# EAGLE schematic shield1 (EAGLE 9.0.1)
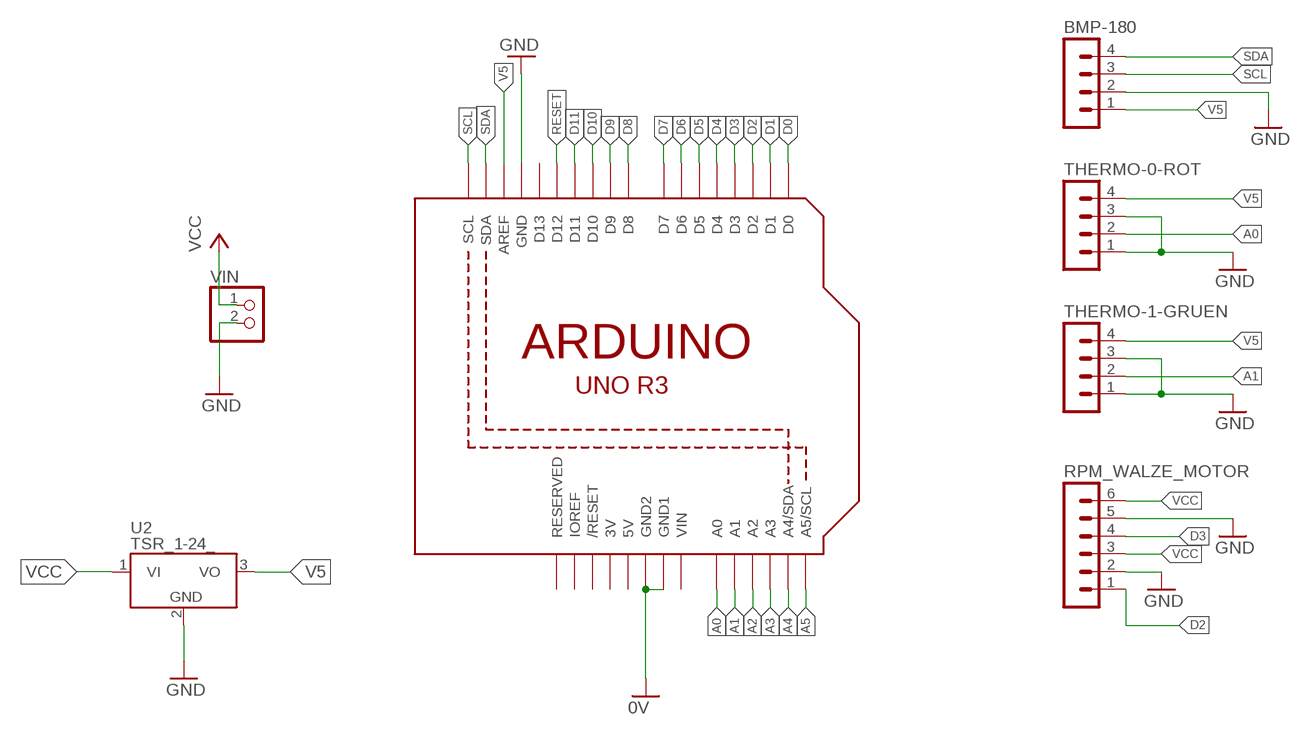
[diagram p0: schematic, sheet 1]

## Parts
BMP-180  MA04-1  [MA04-1]
RPM_WALZE_MOTOR  MA06-1  [MA06-1]
THERMO-0-ROT  MA04-1  [MA04-1]
THERMO-1-GRUEN  MA04-1  [MA04-1]
U1  ARDUINOR3-BPLACE  [ARDUINOR3-BPLACE]
U2  TSR_1-24_  [TSR-1]
VIN  PINHD-1X2  [1X02]

## Nets
A0: THERMO-0-ROT.2 U1.A0
A1: THERMO-1-GRUEN.2 U1.A1
A2: U1.A2
A3: U1.A3
A4: U1.A4(A4/SDA)
A5: U1.A5(A5/SCL)
D0: U1.D0
D1: U1.D1
D2: RPM_WALZE_MOTOR.1 U1.D2
D3: RPM_WALZE_MOTOR.4 U1.D3
D4: U1.D4
D5: U1.D5
D6: U1.D6
D7: U1.D7
D8: U1.D8
D9: U1.D9
D10: U1.D10
D11: U1.D11
GND: BMP-180.2 RPM_WALZE_MOTOR.2 RPM_WALZE_MOTOR.5 THERMO-0-ROT.1 THERMO-0-ROT.3 THERMO-1-GRUEN.1 THERMO-1-GRUEN.3 U1.GND U1.GND1 U1.GND2 U2.2(GND) VIN.2 ; supply symbol labelled 0V
RESET: U1.D12
SCL: BMP-180.3 U1.SCL
SDA: BMP-180.4 U1.SDA
V5: BMP-180.1 THERMO-0-ROT.4 THERMO-1-GRUEN.4 U1.AREF U2.3(VO)
VCC: RPM_WALZE_MOTOR.3 RPM_WALZE_MOTOR.6 U2.1(VI) VIN.1
Unconnected: U1.D13 U1.IOREF U1.RESERVED U1.RESET(/RESET)

## Power pins joined to a net without a drawn wire
3V: U1.3V
5V: U1.5V
VIN: U1.VIN

## Library data of the parts
BMP-180 THERMO-0-ROT THERMO-1-GRUEN = con-lstb:MA04-1: PIN HEADER; OC_FARNELL: unknown; OC_NEWARK: unknown
RPM_WALZE_MOTOR = con-lstb:MA06-1: PIN HEADER; OC_FARNELL: unknown; OC_NEWARK: unknown
U1 = adafruit:ARDUINOR3: This is a new object for the new Arduino R3 - with extra pins that you may want to use (such as IOref, and duplicated A4/A5
U2 = _traco_tsr-1:TSR_1-*: TRACO TSR-1 Series Point-of-Load DC/DC-Converters Vi max. 36 V; Vo = (1.2 .. 15)V ±2%; Io = 0 .. 1 A SIP-Package (drop-in replacement for 78xx linear voltage regulators in TO220-package, vertically assembled) Source: www.tracopower.com Technologies: TSR 1- Vi (V) Vo (V) ±2% Io = 0 .. 1 A 24_ ( generic ) 2412 4.6 .. 36 1.2 2415 4.6 .. 36 1.5 2418 4.6 .. 36 1.8 2425 4.6 .. 36 2.5 2433 4.75.. 36 3.3 2450 6.5 .. 36 5.0 2465 9.0 .. 36 6.5 2490 12 .. 36 9.0 24120 15 .. 36 12 24150 18 .. 36 15 Author: Dipl.-Ing. FH Rainer Bayer HHN Hochschule Heilbronn, rainer.bayer@hs-heilbronn.de Ingenieurbüro ing-rb, mail@ing-rb.de
VIN = pinhead:PINHD-1X2: PIN HEADER